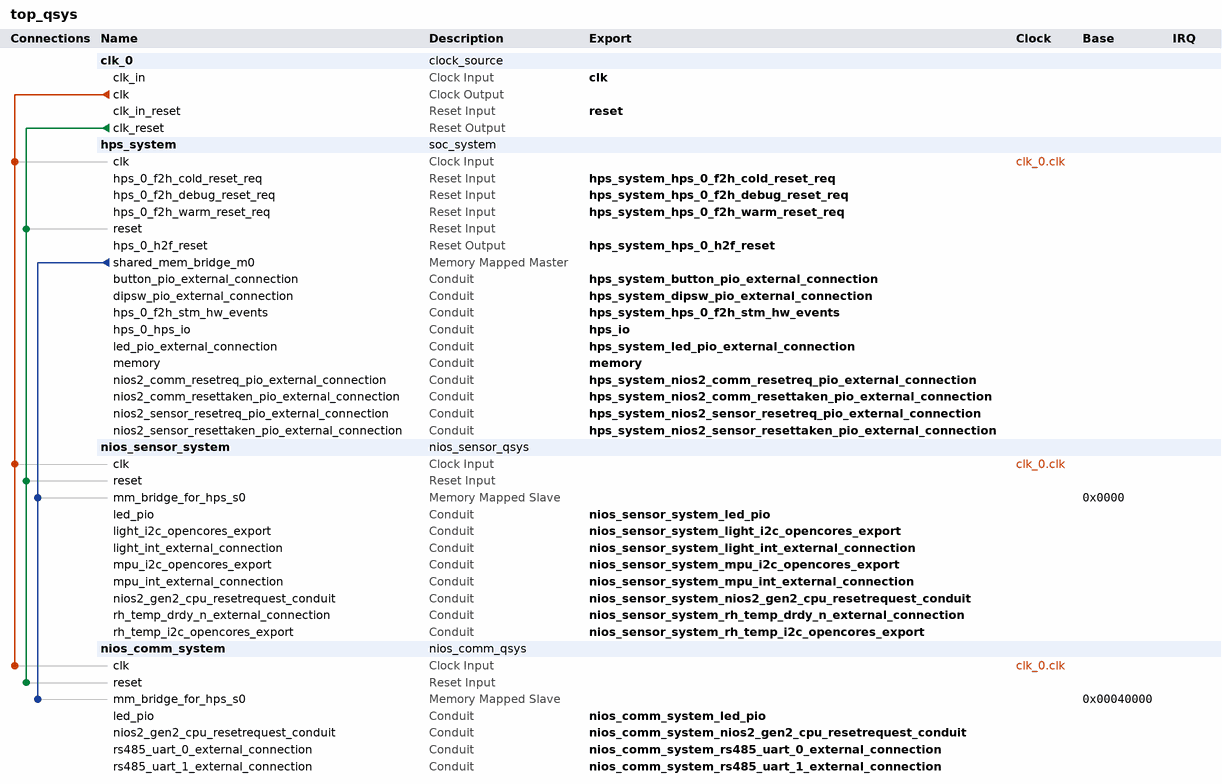
[diagram p0: system contents]
# Platform Designer (Qsys) system top_qsys, Cyclone V 5CSEBA6U23I7
# Parameters at their usual value, and those the tool derives, are not listed.
package require -exact qsys 21.1
create_system top_qsys
set_project_property DEVICE_FAMILY {Cyclone V}
set_project_property DEVICE 5CSEBA6U23I7

add_instance clk_0 clock_source 21.1
set_instance_parameter_value clk_0 clockFrequency 50000000

add_instance hps_system soc_system 1.0

add_instance nios_sensor_system nios_sensor_qsys 1.0

add_instance nios_comm_system nios_comm_qsys 1.0

# connections
add_connection clk_0.clk hps_system.clk clock
add_connection clk_0.clk nios_comm_system.clk clock
add_connection clk_0.clk nios_sensor_system.clk clock
add_connection clk_0.clk_reset hps_system.reset reset
add_connection clk_0.clk_reset nios_comm_system.reset reset
add_connection clk_0.clk_reset nios_sensor_system.reset reset
add_connection hps_system.shared_mem_bridge_m0 nios_comm_system.mm_bridge_for_hps_s0 avalon
set_connection_parameter_value hps_system.shared_mem_bridge_m0/nios_comm_system.mm_bridge_for_hps_s0 baseAddress 0x00040000
add_connection hps_system.shared_mem_bridge_m0 nios_sensor_system.mm_bridge_for_hps_s0 avalon
set_connection_parameter_value hps_system.shared_mem_bridge_m0/nios_sensor_system.mm_bridge_for_hps_s0 baseAddress 0x0000

# exported interfaces
add_interface clk clock sink
set_interface_property clk EXPORT_OF clk_0.clk_in
add_interface hps_io conduit end
set_interface_property hps_io EXPORT_OF hps_system.hps_0_hps_io
add_interface hps_system_button_pio_external_connection conduit end
set_interface_property hps_system_button_pio_external_connection EXPORT_OF hps_system.button_pio_external_connection
add_interface hps_system_dipsw_pio_external_connection conduit end
set_interface_property hps_system_dipsw_pio_external_connection EXPORT_OF hps_system.dipsw_pio_external_connection
add_interface hps_system_hps_0_f2h_cold_reset_req reset sink
set_interface_property hps_system_hps_0_f2h_cold_reset_req EXPORT_OF hps_system.hps_0_f2h_cold_reset_req
add_interface hps_system_hps_0_f2h_debug_reset_req reset sink
set_interface_property hps_system_hps_0_f2h_debug_reset_req EXPORT_OF hps_system.hps_0_f2h_debug_reset_req
add_interface hps_system_hps_0_f2h_stm_hw_events conduit end
set_interface_property hps_system_hps_0_f2h_stm_hw_events EXPORT_OF hps_system.hps_0_f2h_stm_hw_events
add_interface hps_system_hps_0_f2h_warm_reset_req reset sink
set_interface_property hps_system_hps_0_f2h_warm_reset_req EXPORT_OF hps_system.hps_0_f2h_warm_reset_req
add_interface hps_system_hps_0_h2f_reset reset source
set_interface_property hps_system_hps_0_h2f_reset EXPORT_OF hps_system.hps_0_h2f_reset
add_interface hps_system_led_pio_external_connection conduit end
set_interface_property hps_system_led_pio_external_connection EXPORT_OF hps_system.led_pio_external_connection
add_interface hps_system_nios2_comm_resetreq_pio_external_connection conduit end
set_interface_property hps_system_nios2_comm_resetreq_pio_external_connection EXPORT_OF hps_system.nios2_comm_resetreq_pio_external_connection
add_interface hps_system_nios2_comm_resettaken_pio_external_connection conduit end
set_interface_property hps_system_nios2_comm_resettaken_pio_external_connection EXPORT_OF hps_system.nios2_comm_resettaken_pio_external_connection
add_interface hps_system_nios2_sensor_resetreq_pio_external_connection conduit end
set_interface_property hps_system_nios2_sensor_resetreq_pio_external_connection EXPORT_OF hps_system.nios2_sensor_resetreq_pio_external_connection
add_interface hps_system_nios2_sensor_resettaken_pio_external_connection conduit end
set_interface_property hps_system_nios2_sensor_resettaken_pio_external_connection EXPORT_OF hps_system.nios2_sensor_resettaken_pio_external_connection
add_interface memory conduit end
set_interface_property memory EXPORT_OF hps_system.memory
add_interface nios_comm_system_led_pio conduit end
set_interface_property nios_comm_system_led_pio EXPORT_OF nios_comm_system.led_pio
add_interface nios_comm_system_nios2_gen2_cpu_resetrequest_conduit conduit end
set_interface_property nios_comm_system_nios2_gen2_cpu_resetrequest_conduit EXPORT_OF nios_comm_system.nios2_gen2_cpu_resetrequest_conduit
add_interface nios_comm_system_rs485_uart_0_external_connection conduit end
set_interface_property nios_comm_system_rs485_uart_0_external_connection EXPORT_OF nios_comm_system.rs485_uart_0_external_connection
add_interface nios_comm_system_rs485_uart_1_external_connection conduit end
set_interface_property nios_comm_system_rs485_uart_1_external_connection EXPORT_OF nios_comm_system.rs485_uart_1_external_connection
add_interface nios_sensor_system_led_pio conduit end
set_interface_property nios_sensor_system_led_pio EXPORT_OF nios_sensor_system.led_pio
add_interface nios_sensor_system_light_i2c_opencores_export conduit end
set_interface_property nios_sensor_system_light_i2c_opencores_export EXPORT_OF nios_sensor_system.light_i2c_opencores_export
add_interface nios_sensor_system_light_int_external_connection conduit end
set_interface_property nios_sensor_system_light_int_external_connection EXPORT_OF nios_sensor_system.light_int_external_connection
add_interface nios_sensor_system_mpu_i2c_opencores_export conduit end
set_interface_property nios_sensor_system_mpu_i2c_opencores_export EXPORT_OF nios_sensor_system.mpu_i2c_opencores_export
add_interface nios_sensor_system_mpu_int_external_connection conduit end
set_interface_property nios_sensor_system_mpu_int_external_connection EXPORT_OF nios_sensor_system.mpu_int_external_connection
add_interface nios_sensor_system_nios2_gen2_cpu_resetrequest_conduit conduit end
set_interface_property nios_sensor_system_nios2_gen2_cpu_resetrequest_conduit EXPORT_OF nios_sensor_system.nios2_gen2_cpu_resetrequest_conduit
add_interface nios_sensor_system_rh_temp_drdy_n_external_connection conduit end
set_interface_property nios_sensor_system_rh_temp_drdy_n_external_connection EXPORT_OF nios_sensor_system.rh_temp_drdy_n_external_connection
add_interface nios_sensor_system_rh_temp_i2c_opencores_export conduit end
set_interface_property nios_sensor_system_rh_temp_i2c_opencores_export EXPORT_OF nios_sensor_system.rh_temp_i2c_opencores_export
add_interface reset reset sink
set_interface_property reset EXPORT_OF clk_0.clk_in_reset

set_interconnect_requirement {$system} qsys_mm.clockCrossingAdapter HANDSHAKE
set_interconnect_requirement {$system} qsys_mm.enableEccProtection FALSE
set_interconnect_requirement {$system} qsys_mm.insertDefaultSlave FALSE
set_interconnect_requirement {$system} qsys_mm.maxAdditionalLatency 1

save_system top_qsys.qsys
